# EAGLE design wand_io (EAGLE 8.2.0)
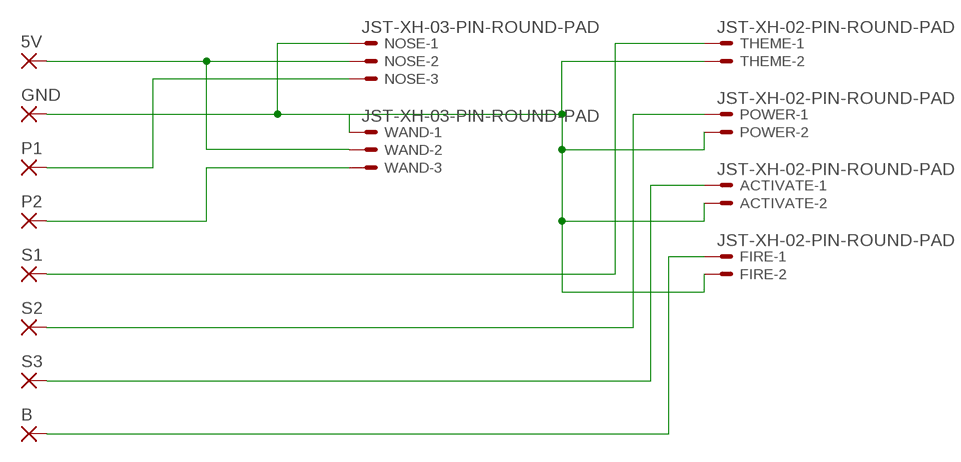
[diagram p0: schematic, sheet 1]

## Parts
5V  2,54/1,1  [2,54/1,1]
ACTIVATE  JST-XH-02-PIN-ROUND-PAD  [JST-XH-02-PACKAGE-ROUND-PAD]
B  2,54/1,1  [2,54/1,1]
FIRE  JST-XH-02-PIN-ROUND-PAD  [JST-XH-02-PACKAGE-ROUND-PAD]
GND  2,54/1,1  [2,54/1,1]
NOSE  JST-XH-03-PIN-ROUND-PAD  [JST-XH-03-PACKAGE-ROUND-PAD]
P1  2,54/1,1  [2,54/1,1]
P2  2,54/1,1  [2,54/1,1]
POWER  JST-XH-02-PIN-ROUND-PAD  [JST-XH-02-PACKAGE-ROUND-PAD]
S1  2,54/1,1  [2,54/1,1]
S2  2,54/1,1  [2,54/1,1]
S3  2,54/1,1  [2,54/1,1]
THEME  JST-XH-02-PIN-ROUND-PAD  [JST-XH-02-PACKAGE-ROUND-PAD]
WAND  JST-XH-03-PIN-ROUND-PAD  [JST-XH-03-PACKAGE-ROUND-PAD]

## Nets
N$1: ACTIVATE.2 FIRE.2 GND.1(P) NOSE.1 POWER.2 THEME.2 WAND.1
N$2: 5V.1(P) NOSE.2 WAND.2
N$3: B.1(P) FIRE.1
N$4: NOSE.3 P1.1(P)
N$5: P2.1(P) WAND.3
N$6: S1.1(P) THEME.1
N$7: POWER.1 S2.1(P)
N$8: ACTIVATE.1 S3.1(P)

## Library data of the parts
5V B GND P1 P2 S1-S3 = wirepad:2,54/1,1: THROUGH-HOLE PAD
ACTIVATE FIRE POWER THEME = Rembrandt Electronics - JST XH Connectors v1-0:JST-XH-02-PIN: JST XH Connector 2 Pin Wire to board connector. Pitch: 2,54 mm, (0.100") Number of pins: 2 Created by Rembrandt Electronics www.rembrandtelectronics.com
NOSE WAND = Rembrandt Electronics - JST XH Connectors v1-0:JST-XH-03-PIN: JST XH Connector 2 Pin Wire to board connector. Pitch: 2,54 mm, (0.100") Number of pins: 3 Created by Rembrandt Electronics www.rembrandtelectronics.com

## Board
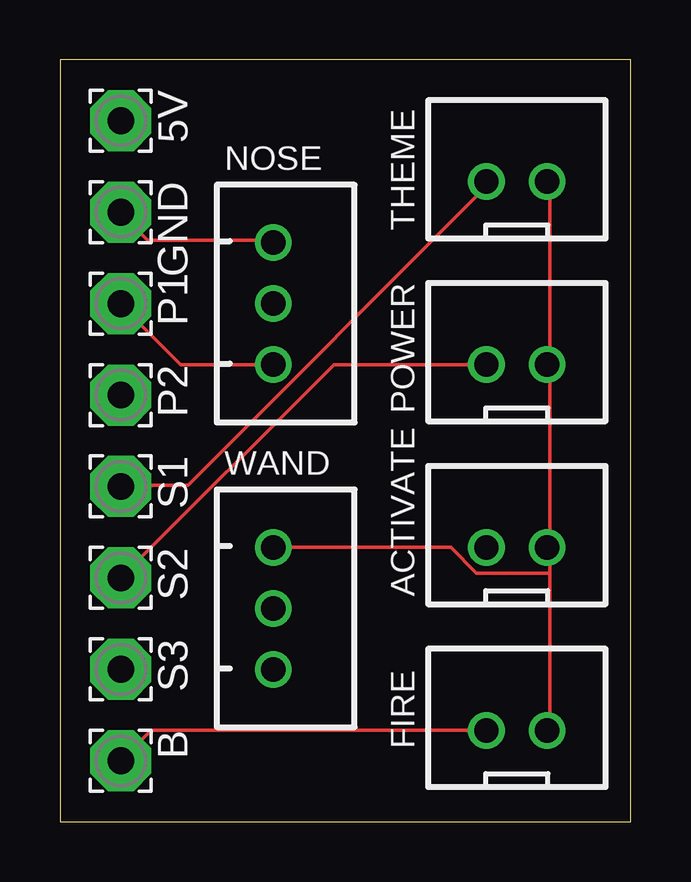
[diagram p1: board, top side]
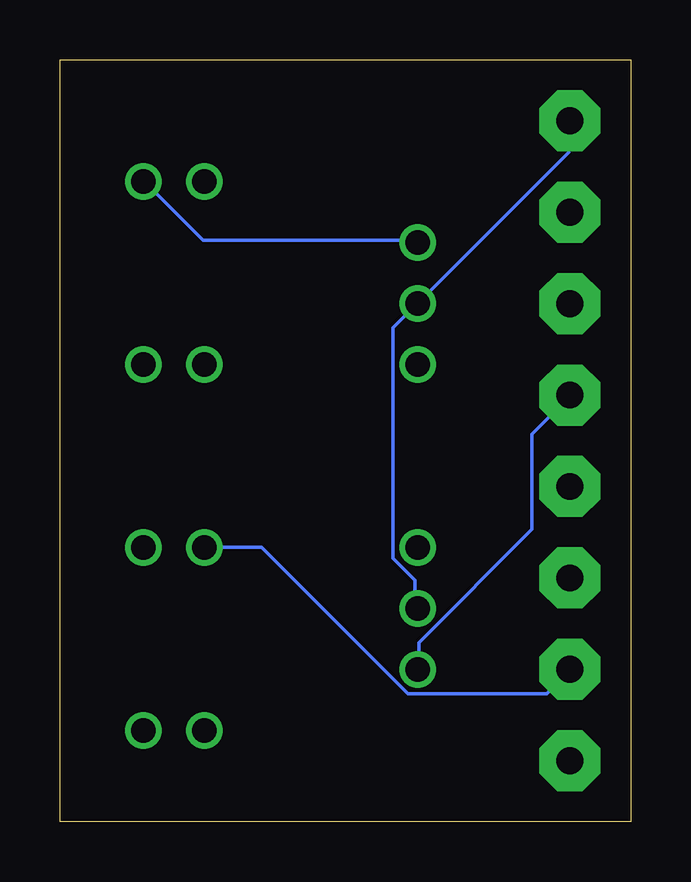
[diagram p2: board, bottom side, seen from below]

Size 23.8 x 31.74 mm. Coordinates in mm from the lower left corner, seen from the top.
Outline: 0,0 23.8,0 23.8,31.74 0,31.74 0,0
Copper layers (1*16): Top 0.035mm / dielectric 1.5mm / Bottom 0.035mm
Design rules "default": minimum track width 6mil, minimum drill 0.35mm, track to track 6mil, track to pad 6mil, pad to pad 6mil, via to via 6mil, smd to smd 6mil, copper to edge 40mil, drill to drill 6mil, minimum pad ring 10mil, minimum via ring 8mil, stop-mask expansion 4mil, vias tented up to drill 0mil, thermal gap 10mil

### Footprints (pad centres in the part's own frame; a part is rotated, then mirrored left to right if it is on the bottom)
2,54/1,1 = drill 1.118 pad 2.54 octagon: 1 0,0
JST-XH-02-PACKAGE-ROUND-PAD = drill 1.016: 1 -1.27,0; 2 1.27,0
JST-XH-03-PACKAGE-ROUND-PAD = drill 1.016: 1 -2.54,0; 2 0,0; 3 2.54,0

### Placement (x,y rotation side)
5V  2.54,29.21 270 top
ACTIVATE  19.05,11.43 0 top
B  2.54,2.54 270 top
FIRE  19.05,3.81 0 top
GND  2.54,25.4 270 top
NOSE  8.89,21.59 270 top
P1  2.54,21.59 270 top
P2  2.54,17.78 270 top
POWER  19.05,19.05 0 top
S1  2.54,13.97 270 top
S2  2.54,10.16 270 top
S3  2.54,6.35 270 top
THEME  19.05,26.67 0 top
WAND  8.89,8.89 270 top

### Tracks (layer width: path | path; a pad name or v marks a point on that pad's centre or on a via)
N$1
  Top 0.152: NOSE.1 8.84,24.23 3.66,24.23 2.59,25.3 GND.1 | 20.42,19.05 20.42,26.67 THEME.2 | 20.42,11.43 20.42,10.36 | 20.42,10.36 20.42,3.81 FIRE.2 | WAND.1 16.31,11.43 17.37,10.36 20.42,10.36 | 20.42,11.43 20.42,19.05 | 20.42,19.05 POWER.2 | 20.42,11.43 ACTIVATE.2
  Bottom 0.152: NOSE.1 8.99,24.23 17.83,24.23 20.27,26.67 THEME.2
N$2
  Bottom 0.152: WAND.2 8.99,8.99 8.99,10.06 9.91,10.97 9.91,20.57 NOSE.2 2.59,27.89 2.59,29.11 5V.1
N$3
  Top 0.152: FIRE.1 3.81,3.81 B.1
N$4
  Top 0.152: NOSE.3 5.03,19.05 2.59,21.49 P1.1
N$5
  Bottom 0.152: WAND.3 8.84,6.4 8.84,7.47 4.12,12.19 4.12,16.15 2.59,17.68 P2.1
N$6
  Top 0.152: THEME.1 17.68,26.67 17.68,26.36 5.33,14.02 2.59,14.02 S1.1
N$7
  Top 0.152: POWER.1 11.43,19.05 S2.1
N$8
  Bottom 0.152: ACTIVATE.1 15.39,11.43 9.3,5.33 3.5,5.33 2.59,6.25 S3.1